# EAGLE schematic APS2 (EAGLE 9.6.2)
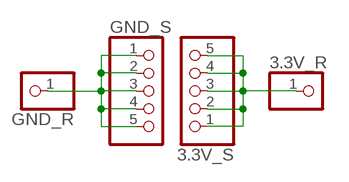
[diagram p0: schematic, sheet 1]

## Parts
3.3V_R  PINHD-1X1  [1X01]
3.3V_S  PINHD-1X5  [1X05]
GND_R  PINHD-1X1  [1X01]
GND_S  PINHD-1X5  [1X05]

## Nets
N$1: GND_R.1 GND_S.1 GND_S.2 GND_S.3 GND_S.4 GND_S.5
N$2: 3.3V_R.1 3.3V_S.1 3.3V_S.2 3.3V_S.3 3.3V_S.4 3.3V_S.5

## Library data of the parts
3.3V_R GND_R = pinhead:PINHD-1X1: PIN HEADER
3.3V_S GND_S = pinhead:PINHD-1X5: PIN HEADER